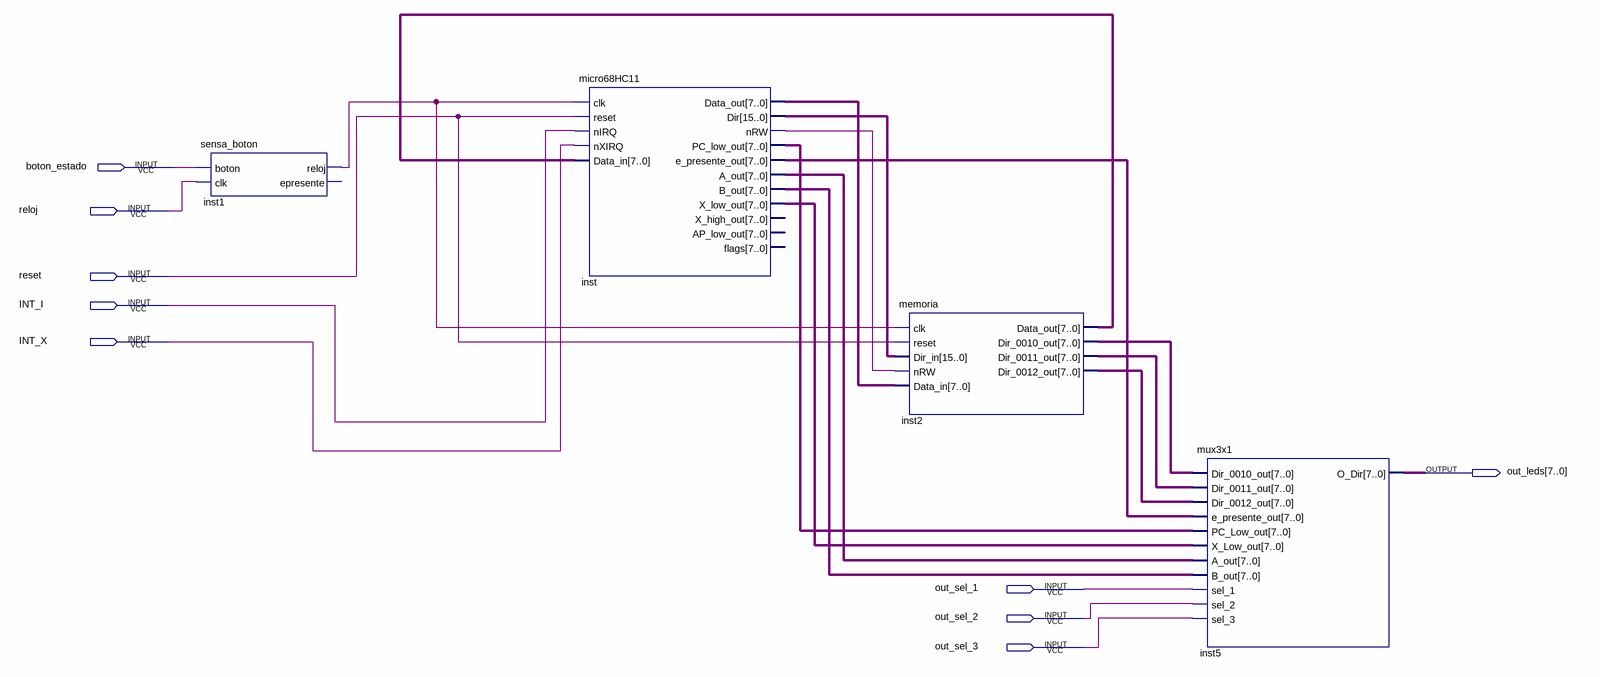
[diagram p0: schematic sheet]
// Quartus schematic Practica6.bdf as structural Verilog: 4 symbols, 9 pins
module Practica6 (
  input  boton_estado,
  input  reloj,
  input  reset,
  input  INT_I,
  input  INT_X,
  input  out_sel_1,
  input  out_sel_2,
  input  out_sel_3,
  output [7:0] out_leds
);

  wire inst1_reloj, inst_nrw;
  wire [7:0] inst2_data_out, inst2_dir_0010_out, inst2_dir_0011_out, inst2_dir_0012_out, inst_a_out,
       inst_b_out, inst_data_out, inst_e_presente_out, inst_pc_low_out, inst_x_low_out;
  wire [15:0] inst_dir;

  sensa_boton inst1 (.boton(boton_estado), .clk(reloj), .reloj(inst1_reloj));  // open: epresente
  micro68HC11 inst (
    .clk(inst1_reloj), .reset(reset), .nIRQ(INT_I), .nXIRQ(INT_X), .Data_in(inst2_data_out),
    .Data_out(inst_data_out), .Dir(inst_dir), .nRW(inst_nrw), .PC_low_out(inst_pc_low_out),
    .e_presente_out(inst_e_presente_out), .A_out(inst_a_out), .B_out(inst_b_out), .X_low_out(inst_x_low_out));  // open: X_high_out, AP_low_out, flags
  memoria inst2 (
    .clk(inst1_reloj), .reset(reset), .Dir_in(inst_dir), .nRW(inst_nrw), .Data_in(inst_data_out),
    .Data_out(inst2_data_out), .Dir_0010_out(inst2_dir_0010_out), .Dir_0011_out(inst2_dir_0011_out),
    .Dir_0012_out(inst2_dir_0012_out));
  mux3x1 inst5 (
    .Dir_0010_out(inst2_dir_0010_out), .Dir_0011_out(inst2_dir_0011_out), .Dir_0012_out(inst2_dir_0012_out),
    .e_presente_out(inst_e_presente_out), .PC_Low_out(inst_pc_low_out), .X_Low_out(inst_x_low_out),
    .A_out(inst_a_out), .B_out(inst_b_out), .sel_1(out_sel_1), .sel_2(out_sel_2), .sel_3(out_sel_3),
    .O_Dir(out_leds));
endmodule
